# Altium project abacus_main.PrjPcb
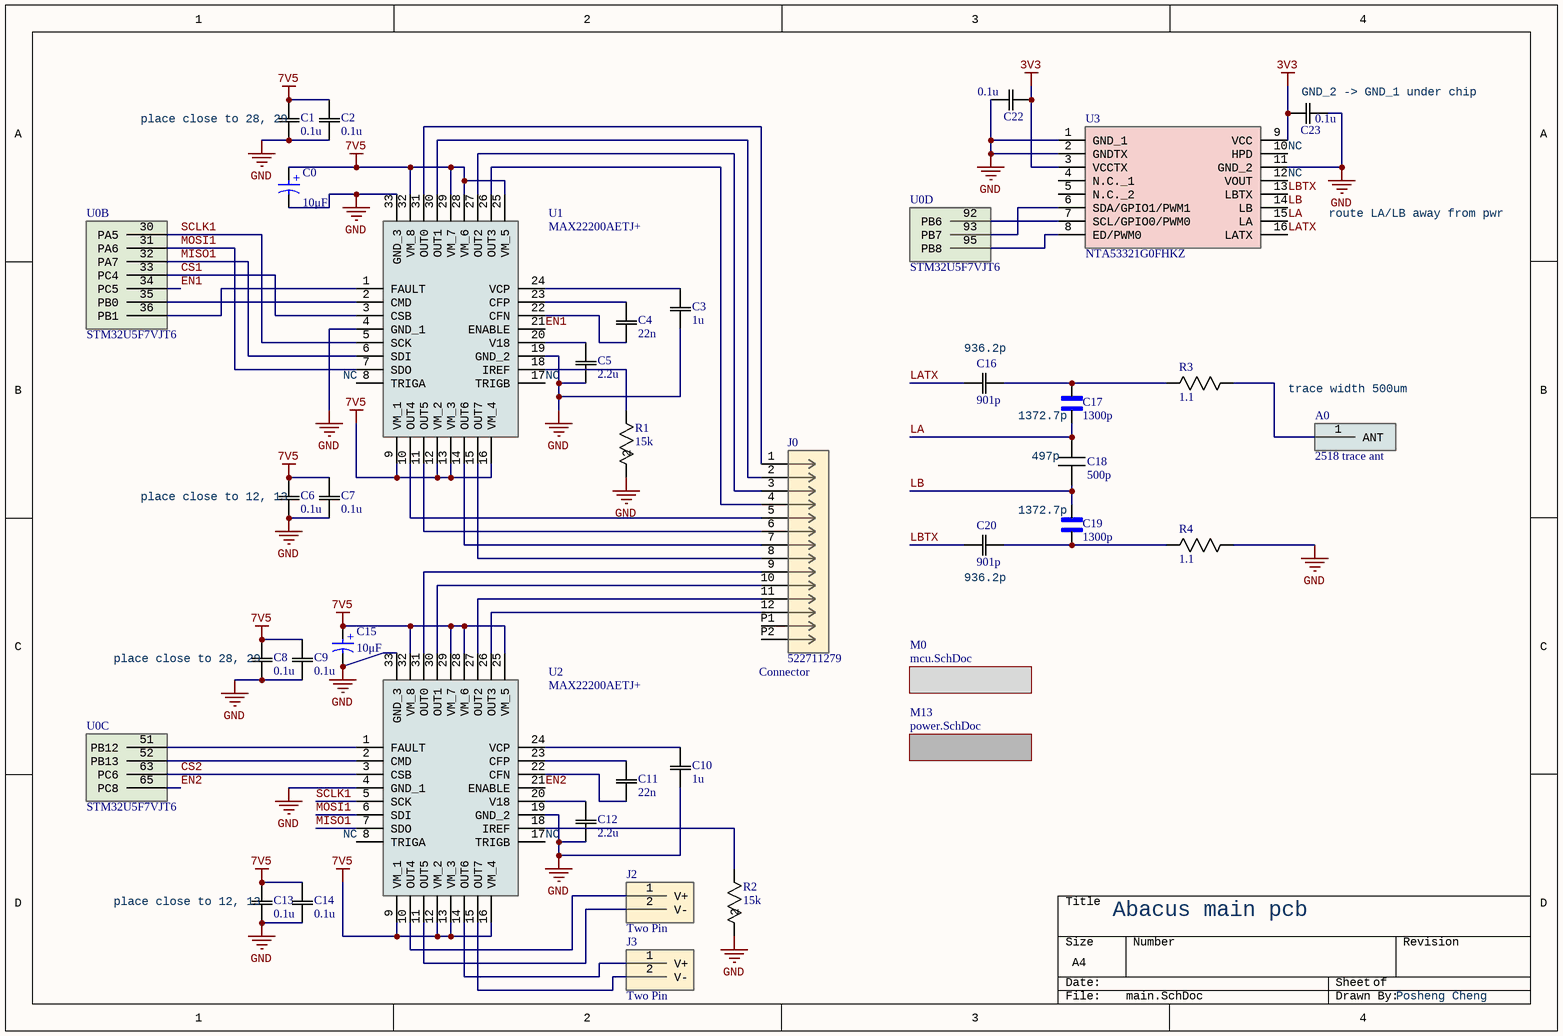
[diagram p0: main.SchDoc]
4 sheets, 117 parts. Net scope: flat (ports and power ports of the same name join across sheets).
Board file: main.PcbDoc
Sheets:
  main.SchDoc
    M0 = mcu.SchDoc
      M9 = hall.SchDoc
      M10 = hall.SchDoc
      M11 = hall.SchDoc
      M12 = hall.SchDoc
      M1 = hall.SchDoc
      M2 = hall.SchDoc
      M3 = hall.SchDoc
      M4 = hall.SchDoc
      M5 = hall.SchDoc
      M6 = hall.SchDoc
      M7 = hall.SchDoc
      M8 = hall.SchDoc
    M13 = power.SchDoc

## Sheet main.SchDoc: Abacus main pcb
size A4; DrawnBy: Posheng Cheng; DocumentNumber: 1; SheetNumber: 1; SheetTotal: 4; SPICEModelCacheAYXZMGLR: <root> / <DocumentId>AYXZMGLR</DocumentId> / <CacheFrame Number="0"> / <Model Name="865080340001_10uf" Kind="CKT"> / <Text>******* / .subckt 865080340001_10uF 1 2 / Rser 1 3 1.3 / Lser 2 4 6.62786597E-10 / C1 3 4 0.00001 / Rpar 3 4 5333333.33333333 / .ends 865080340001_10uF</Text> / </Model> / </CacheFrame> / </root>

### Parts
(Parts that share a designator on the sheet are numbered #1, #2 ... from top to bottom, then left to right.)
A0  2518 trace ant  [NFCANT]
C0  10μF  [WCAP-ASLI_D4H5.5]
C1  0.1u  [CAP_CC0201_YAG]
C2  0.1u  [CAP_CC0201_YAG]
C3  1u  [CAP_CC0201_YAG]
C4  22n  [CAP_CC0201_YAG]
C5  2.2u  [CAP_CC0201_YAG]
C6  0.1u  [CAP_CC0201_YAG]
C7  0.1u  [CAP_CC0201_YAG]
C8  0.1u  [CAP_CC0201_YAG]
C9  0.1u  [CAP_CC0201_YAG]
C10  1u  [CAP_CC0201_YAG]
C11  22n  [CAP_CC0201_YAG]
C12  2.2u  [CAP_CC0201_YAG]
C13  0.1u  [CAP_CC0201_YAG]
C14  0.1u  [CAP_CC0201_YAG]
C15  10μF  [WCAP-ASLI_D4H5.5]
C16  901p  [CAPC17595_87N_KEM]
C17  1300p  [CAPC1608X95N]
C18  500p  [CAPC17595_87N_KEM]
C19  1300p  [CAPC1608X95N]
C20  901p  [CAPC17595_87N_KEM]
C22  0.1u  [CAP_CC0201_YAG]
C23  0.1u  [CAP_CC0201_YAG]
J0  522711279  System: Connector  [CON_522711279_MOL]
J2  Two Pin  [TWO_PIN]
J3  Two Pin  [TWO_PIN]
R1  15k  [RC0603N_PAN]
R2  15k  [RC0603N_PAN]
R3  1.1  [RC0603N_PAN]
R4  1.1  [RC0603N_PAN]
U0#1  STM32U5F7VJT6  [QFP50P1600X1600X160-100N]  (part D of 4)
U0#2  STM32U5F7VJT6  [QFP50P1600X1600X160-100N]  (part B of 2)
U0#3  STM32U5F7VJT6  [QFP50P1600X1600X160-100N]  (part C of 3)
U1  MAX22200AETJ+  [QFN50P500X500X80-33N]
U2  MAX22200AETJ+  [QFN50P500X500X80-33N]
U3  NTA53321G0FHKZ  [NTA53321G0FHKZ]

### Sub-sheets
M0 = mcu.SchDoc: no entries
M13 = power.SchDoc: no entries

### Nets
3V3: C22.2 C23.1 U3.3(VCCTX) U3.9(VCC)
7V5: C0.1(P) C1.2 C2.2 C6.2 C7.2 C8.2 C9.2 C13.2 C14.2 C15.1(P) U1.9(VM_1) U1.12(VM_2) U1.13(VM_3) U1.16(VM_4) U1.25(VM_5) U1.28(VM_6) U1.29(VM_7) U1.32(VM_8) U2.9(VM_1) U2.12(VM_2) U2.13(VM_3) U2.16(VM_4) U2.25(VM_5) U2.28(VM_6) U2.29(VM_7) U2.32(VM_8)
GND: C0.2(N) C1.1 C2.1 C3.1 C5.1 C6.1 C7.1 C8.1 C9.1 C10.1 C12.1 C13.1 C14.1 C15.2(N) C22.1 C23.2 R1.2 R2.2 R4.1 U1.4(GND_1) U1.19(GND_2) U1.33(GND_3) U2.4(GND_1) U2.19(GND_2) U2.33(GND_3) U3.1(GND_1) U3.2(GNDTX) U3.11(GND_2)
CS1: U0#2.33(PC4) U1.3(CSB)
CS2: U0#3.63(PC6) U2.3(CSB)
EN1: U0#2.34(PC5) U1.21(ENABLE)
EN2: U0#3.65(PC8) U2.21(ENABLE)
LA: C17.1 C18.2 U3.15(LA)
LATX: C16.2 U3.16(LATX)
LB: C18.1 C19.2 U3.14(LB)
LBTX: C20.2 U3.13(LBTX)
MISO1: U0#2.32(PA7) U1.6(SDI) U2.7(SDO)
MOSI1: U0#2.31(PA6) U1.7(SDO) U2.6(SDI)
SCLK1: U0#2.30(PA5) U1.5(SCK) U2.5(SCK)
NetA0_1: A0.1(ANT) R3.1
NetC3_2: C3.2 U1.24(VCP)
NetC4_1: C4.1 U1.22(CFN)
NetC4_2: C4.2 U1.23(CFP)
NetC5_2: C5.2 U1.20(V18)
NetC10_2: C10.2 U2.24(VCP)
NetC11_1: C11.1 U2.22(CFN)
NetC11_2: C11.2 U2.23(CFP)
NetC12_2: C12.2 U2.20(V18)
NetC16_1: C16.1 C17.2 R3.2
NetC19_1: C19.1 C20.1 R4.2
NetJ0_1: J0.1 U1.31(OUT0)
NetJ0_2: J0.2 U1.30(OUT1)
NetJ0_3: J0.3 U1.27(OUT2)
NetJ0_4: J0.4 U1.26(OUT3)
NetJ0_5: J0.5 U1.10(OUT4)
NetJ0_6: J0.6 U1.11(OUT5)
NetJ0_7: J0.7 U1.14(OUT6)
NetJ0_8: J0.8 U1.15(OUT7)
NetJ0_9: J0.9 U2.31(OUT0)
NetJ0_10: J0.10 U2.30(OUT1)
NetJ0_11: J0.11 U2.27(OUT2)
NetJ0_12: J0.12 U2.26(OUT3)
NetJ2_1: J2.1(V+) U2.10(OUT4)
NetJ2_2: J2.2(V-) U2.11(OUT5)
NetJ3_1: J3.1(V+) U2.14(OUT6)
NetJ3_2: J3.2(V-) U2.15(OUT7)
NetR1_1: R1.1 U1.18(IREF)
NetR2_1: R2.1 U2.18(IREF)
NetU0#1_92: U0#1.92(PB6) U3.7(SCL/GPIO0/PWM0)
NetU0#1_93: U0#1.93(PB7) U3.6(SDA/GPIO1/PWM1)
NetU0#1_95: U0#1.95(PB8) U3.8(ED/PWM0)
NetU0#2_35: U0#2.35(PB0) U1.2(CMD)
NetU0#2_36: U0#2.36(PB1) U1.1(FAULT)
NetU0#3_51: U0#3.51(PB12) U2.1(FAULT)
NetU0#3_52: U0#3.52(PB13) U2.2(CMD)

Not connected (* = marked no-connect by the designer): J0 P1 P2; U1 8(TRIGA) 17(TRIGB); U2 8(TRIGA) 17(TRIGB); U3 4(N.C._1) 5(N.C._2) 10(HPD) 12(VOUT)

### Notes on the sheet
- (near C23) GND_2 -> GND_1 under chip
- (near C1) place close to 28, 29
- (near U3) NC
- NC
- route LA/LB away from pwr
- (near U1) NC
- (near C16) 936.2p
- (near C17) 1372.7p
- (near A0) trace width 500um
- (near C6) place close to 12, 13
- (near C19) 1372.7p
- (near C18) 497p
- (near C20) 936.2p
- (near C8) place close to 28, 29
- (near U2) NC
- (near C13) place close to 12, 13
- (in symbol 865080340001) +

### Library data of the parts
A0 = Component_1
C0 C15 = 865080340001: WCAP-ASLI Aluminum Electrolytic Capacitor, V-Chip, SMT, 4mm x 5.5mm, 10μF, 16V; Manufacturer: Wurth Elektronik; Dissipation Factor: 16%; Endurance: 2000h; Impedance: 2200mΩ; Leakage Current: 3μA; Ripple Current: 80mA; Manufacturer_Part_Number: 865080340001; Category: Aluminum Electrolytic Capacitors; Match Code: WCAP-ASLI; ComponentLink1Description: Website Link; ComponentLink1URL: https://www.we-online.com/redexpert/article/865080340001?ad; ComponentLink2Description: Datasheet Link; ComponentLink2URL: https://www.we-online.com/redexpert/spec/865080340001?ad; Mount: Surface Mount; Min Operating Temperature: -55°C; Max Operating Temperature: 105°C; Packaging: Tape and Reel; Height: 5.5mm; Diameter: 4mm; Capacitance: 10μF; Rated Voltage (DC): 16V
C1 C2 C6-C9 C13 C14 = CC0201KRX5R7BB104: Description; Manufacturer_Name: Yageo; Copyright: Copyright (C) 2025 Ultra Librarian. All rights reserved.; Manufacturer_Part_Number: CC0201KRX5R7BB104
C3 C10 = CC0201MRX5R5BB105: No Description Available; Manufacturer_Name: Yageo; Copyright: Copyright (C) 2025 Ultra Librarian. All rights reserved.; Manufacturer_Part_Number: CC0201MRX5R5BB105
C4 C11 = CC0201KRX5R7BB223: No Description Available; Manufacturer_Name: Yageo; Copyright: Copyright (C) 2025 Ultra Librarian. All rights reserved.; Manufacturer_Part_Number: CC0201KRX5R7BB223
C5 C12 = CC0201MRX5R5BB225: No Description Available; Manufacturer_Name: Yageo; Copyright: Copyright (C) 2025 Ultra Librarian. All rights reserved.; Manufacturer_Part_Number: CC0201MRX5R5BB225
C16 C20 = C0603C911F5GACTU: SMD Comm C0G, Ceramic, 910 pF, 1%, 50 VDC, C0G, SMD, MLCC, Ultra-Stable, Low Loss, Class I, 0603; Manufacturer_Name: Kemet; Copyright: Copyright (C) 2025 Ultra Librarian. All rights reserved.; Manufacturer_Part_Number: C0603C911F5GACTU; Datasheet: https://content.kemet.com/datasheets/KEM_C1003_C0G_SMD.pdf
C17 C19 = C0603X132F4HACTU: CAP CER 0603 1.3NF 16V ULTRA STA; MF: KEMET; MP: C0603X132F4HAC7867; SnapEDA_Link: https://www.snapeda.com/parts/C0603X132F4HAC7867/KEMET/view-part/?ref=snap; Package: 1608 KEMET; Value: *; Check_prices: https://www.snapeda.com/parts/C0603X132F4HAC7867/KEMET/view-part/?ref=eda; Manufacturer_Part_Number: C0603X132F4HACTU
C18 = CC0603JRNPO9BN501: CC0603JRNPO9BN501 500pF 5%, 50 VDC 0603; Manufacturer_Part_Number: CC0603JRNPO9BN501
C22 C23 = CMP-001-00086-1: Description; Manufacturer_Name: Yageo; Copyright: Copyright (C) 2025 Ultra Librarian. All rights reserved.; Design Item ID: CC0201KRX5R7BB104; Manufacturer_Part_Number: CC0201KRX5R7BB104; Source: CC0201KRX5R7BB104.SchLib
J0 = 522711279: Easy-On FFC/FPC Connector, 1.00mm Pitch, Slider Series, Right-Angle, Bottom Contact, 3.00mm Height, 12 Circuits, Tin-Bismuth Plating; Manufacturer_Name: Molex Connector Corporation; Copyright: Copyright (C) 2025 Ultra Librarian. All rights reserved.; Manufacturer_Part_Number: 522711279; RefDes: RefDes; Type: Type
J2 J3 = two_pin
R1 R2 = ERA-3AEB153V: No Description Available; Manufacturer_Name: Panasonic; Copyright: Copyright (C) 2025 Ultra Librarian. All rights reserved.; Manufacturer_Part_Number: ERA-3AEB153V
R3 R4 = RT0603DRE071R1L: YAGEO, RT, Thin Film, SMD Chip, 1.1 Ohms, 0.5%, 0603 / 1608; Copyright: Copyright (C) 2025 Ultra Librarian. All rights reserved.; Manufacturer_Name: YAGEO; Manufacturer_Part_Number: RT0603DRE071R1L
U0#1-U0#3 = STM32U5F7VJT6: Advanced Graphics and Ultra Low Power  CortexM-33 with Trustzone, NEOCHROM VG GPU, 160MHZ, with 3 MBSRAM and 4M of Flash.; Manufacturer_Name: STMicroelectronics; Geometry.Height: 1.6mm; Manufacturer_Part_Number: STM32U5F7VJT6; Mouser Part Number: 511-STM32U5F7VJT6; Mouser Price/Stock: https://www.mouser.co.uk/ProductDetail/STMicroelectronics/STM32U5F7VJT6?qs=HoCaDK9Nz5e1ZGsW1DPWFA%3D%3D; Arrow Part Number: STM32U5F7VJT6; Arrow Price/Stock: https://www.arrow.com/en/products/stm32u5f7vjt6/stmicroelectronics?region=nac; Datasheet Link: https://www.st.com/resource/en/datasheet/stm32u5f7vj.pdf
U1 U2 = MAX22200AETJ+: Motor/Motion/Ignition Controllers & Drivers 36V, 1A Octal Integrated Serial-Controll; Manufacturer_Name: Analog Devices; Geometry.Height: 0.8mm; Manufacturer_Part_Number: MAX22200AETJ+; Mouser Part Number: *; Mouser Price/Stock: *; Arrow Part Number: MAX22200AETJ+; Arrow Price/Stock: https://www.arrow.com/en/products/max22200aetj/analog-devices?utm_currency=USD&region=nac; Datasheet Link: https://www.analog.com/media/en/technical-documentation/data-sheets/MAX22200.pdf
U3 = NTA53321G0FHKZ: Interface - Specialized NTAG; Manufacturer_Name: NXP; Geometry.Height: 0.5mm; Manufacturer_Part_Number: NTA53321G0FHKZ; Mouser Part Number: 771-NTA53321G0FHKZ; Mouser Price/Stock: https://www.mouser.co.uk/ProductDetail/NXP-Semiconductors/NTA53321G0FHKZ?qs=OlC7AqGiEDk3OpnM8pXHAA%3D%3D; Arrow Part Number: NTA53321G0FHKZ; Arrow Price/Stock: https://www.arrow.com/en/products/nta53321g0fhkz/nxp-semiconductors?region=nac; Datasheet Link: https://www.mouser.co.il/datasheet/2/302/NTA5332-1815294.pdf

## Sheet mcu.SchDoc: Abacus main PCB - MCU
size A4; DrawnBy: Posheng Cheng; SheetNumber: 2; SheetTotal: 3
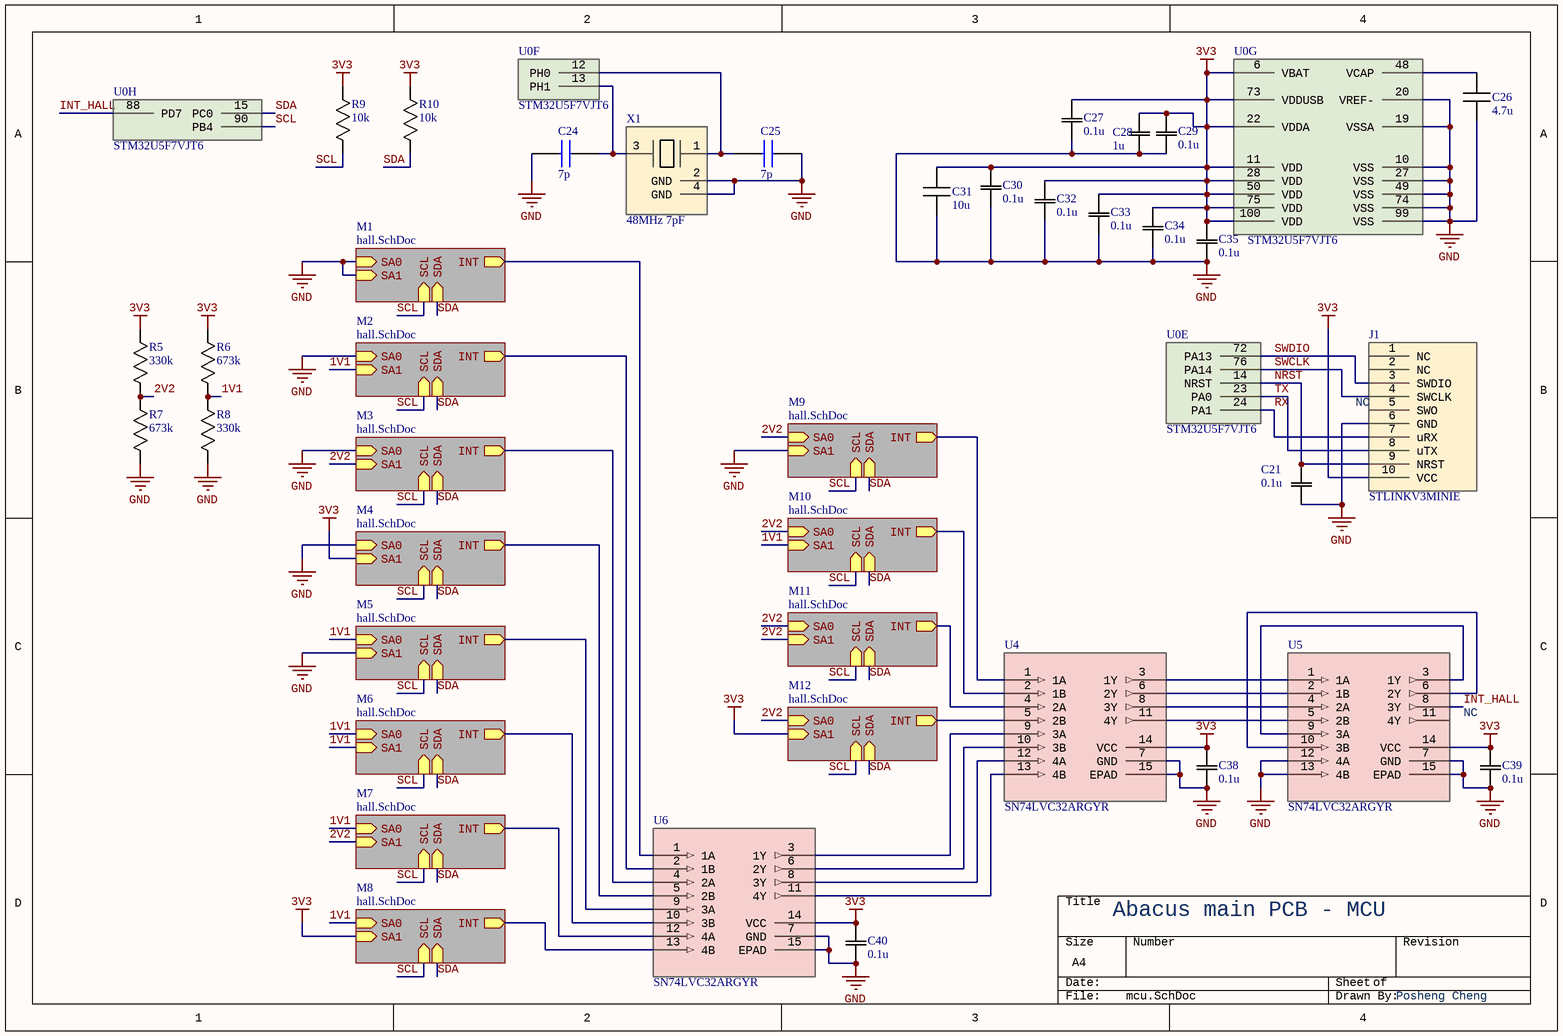
[diagram p1: mcu.SchDoc]

### Parts
(Parts that share a designator on the sheet are numbered #1, #2 ... from top to bottom, then left to right.)
C21  0.1u  [CAP_CC0201_YAG]
C24  7p  [CAPC0603X33N]
C25  7p  [CAPC0603X33N]
C26  4.7u  [CAPC17595_87N_KEM]
C27  0.1u  [CAP_CC0201_YAG]
C28  1u  [CAP_CC0201_YAG]
C29  0.1u  [CAP_CC0201_YAG]
C30  0.1u  [CAP_CC0201_YAG]
C31  10u  [CAPC17595_87N_KEM]
C32  0.1u  [CAP_CC0201_YAG]
C33  0.1u  [CAP_CC0201_YAG]
C34  0.1u  [CAP_CC0201_YAG]
C35  0.1u  [CAP_CC0201_YAG]
C38  0.1u  [CAP_CC0201_YAG]
C39  0.1u  [CAP_CC0201_YAG]
C40  0.1u  [CAP_CC0201_YAG]
J1  STLINKV3MINIE  [009159010061911]
R5  330k  [RC0603N_YAG]
R6  673k  [RC0603N_YAG]
R7  673k  [RC0603N_YAG]
R8  330k  [RC0603N_YAG]
R9  10k  [RC0603N_PAN]
R10  10k  [RC0603N_PAN]
U0#4  STM32U5F7VJT6  [QFP50P1600X1600X160-100N]  (part F of 6)
U0#5  STM32U5F7VJT6  [QFP50P1600X1600X160-100N]  (part G of 7)
U0#6  STM32U5F7VJT6  [QFP50P1600X1600X160-100N]  (part H of 8)
U0#7  STM32U5F7VJT6  [QFP50P1600X1600X160-100N]  (part E of 5)
U4  SN74LVC32ARGYR  [RGY14_2P05X2P05]
U5  SN74LVC32ARGYR  [RGY14_2P05X2P05]
U6  SN74LVC32ARGYR  [RGY14_2P05X2P05]
X1  48MHz 7pF  [ECS-480-7-33B2-CKM-TR3]

### Sub-sheets
M1 = hall.SchDoc: SA0 (in), SA1 (in), SCL (in), SDA (in), INT (out)
M2 = hall.SchDoc: SA0 (in), SA1 (in), SCL (in), SDA (in), INT (out)
M3 = hall.SchDoc: SA0 (in), SA1 (in), SCL (in), SDA (in), INT (out)
M4 = hall.SchDoc: SA0 (in), SA1 (in), SCL (in), SDA (in), INT (out)
M5 = hall.SchDoc: SA0 (in), SA1 (in), SCL (in), SDA (in), INT (out)
M6 = hall.SchDoc: SA0 (in), SA1 (in), SCL (in), SDA (in), INT (out)
M7 = hall.SchDoc: SA0 (in), SA1 (in), SCL (in), SDA (in), INT (out)
M8 = hall.SchDoc: SA0 (in), SA1 (in), SCL (in), SDA (in), INT (out)
M9 = hall.SchDoc: SA0 (in), SA1 (in), SCL (in), SDA (in), INT (out)
M10 = hall.SchDoc: SA0 (in), SA1 (in), SCL (in), SDA (in), INT (out)
M11 = hall.SchDoc: SA0 (in), SA1 (in), SCL (in), SDA (in), INT (out)
M12 = hall.SchDoc: SA0 (in), SA1 (in), SCL (in), SDA (in), INT (out)

### Nets
3V3: C27.2 C28.2 C29.2 C30.2 C31.2 C32.2 C33.2 C34.2 C35.2 C38.1 C39.1 C40.1 J1.10(VCC) R5.1 R6.1 R9.1 R10.2 U0#5.6(VBAT) U0#5.11(VDD) U0#5.22(VDDA) U0#5.28(VDD) U0#5.50(VDD) U0#5.73(VDDUSB) U0#5.75(VDD) U0#5.100(VDD) U4.14(VCC) U5.14(VCC) U6.14(VCC) ; sheet M12/SA1, sheet M4/SA1, sheet M8/SA1
GND: C21.1 C24.1 C25.2 C26.1 C27.1 C28.1 C29.1 C30.1 C31.1 C32.1 C33.1 C34.1 C35.1 C38.2 C39.2 C40.2 J1.6(GND) R7.2 R8.2 U0#5.10(VSS) U0#5.19(VSSA) U0#5.20(VREF-) U0#5.27(VSS) U0#5.49(VSS) U0#5.74(VSS) U0#5.99(VSS) U4.7(GND) U4.15(EPAD) U5.7(GND) U5.12(4A) U5.13(4B) U5.15(EPAD) U6.7(GND) U6.15(EPAD) X1.2(GND) X1.4(GND) ; sheet M9/SA1, sheet M1/SA0, sheet M1/SA1, sheet M2/SA0, sheet M3/SA0, sheet M4/SA0, sheet M5/SA1
1V1: R6.2 R8.1 ; sheet M10/SA1, sheet M2/SA1, sheet M5/SA0, sheet M6/SA0, sheet M6/SA1, sheet M7/SA0, sheet M8/SA0
2V2: R5.2 R7.1 ; sheet M9/SA0, sheet M10/SA0, sheet M11/SA0, sheet M11/SA1, sheet M12/SA0, sheet M3/SA1, sheet M7/SA1
INT_HALL: U0#6.88(PD7) U5.8(3Y)
NRST: C21.2 J1.9(NRST) U0#7.14(NRST)
RX: J1.7(uRX) U0#7.24(PA1)
SCL: R9.2 U0#6.90(PB4) ; sheet M9/SCL, sheet M10/SCL, sheet M11/SCL, sheet M12/SCL, sheet M1/SCL, sheet M2/SCL, sheet M3/SCL, sheet M4/SCL, sheet M5/SCL, sheet M6/SCL, sheet M7/SCL, sheet M8/SCL
SDA: R10.1 U0#6.15(PC0) ; sheet M9/SDA, sheet M10/SDA, sheet M11/SDA, sheet M12/SDA, sheet M1/SDA, sheet M2/SDA, sheet M3/SDA, sheet M4/SDA, sheet M5/SDA, sheet M6/SDA, sheet M7/SDA, sheet M8/SDA
SWCLK: J1.4(SWCLK) U0#7.76(PA14)
SWDIO: J1.3(SWDIO) U0#7.72(PA13)
TX: J1.8(uTX) U0#7.23(PA0)
NetC24_2: C24.2 U0#4.13(PH1) X1.3
NetC25_1: C25.1 U0#4.12(PH0) X1.1
NetC26_2: C26.2 U0#5.48(VCAP)
NetU4_1: U4.1(1A) ; sheet M9/INT
NetU4_2: U4.2(1B) ; sheet M10/INT
NetU4_3: U4.3(1Y) U5.1(1A)
NetU4_4: U4.4(2A) ; sheet M11/INT
NetU4_5: U4.5(2B) ; sheet M12/INT
NetU4_6: U4.6(2Y) U5.2(1B)
NetU4_8: U4.8(3Y) U5.4(2A)
NetU4_9: U4.9(3A) U6.3(1Y)
NetU4_10: U4.10(3B) U6.6(2Y)
NetU4_11: U4.11(4Y) U5.5(2B)
NetU4_12: U4.12(4A) U6.8(3Y)
NetU4_13: U4.13(4B) U6.11(4Y)
NetU5_3: U5.3(1Y) U5.9(3A)
NetU5_6: U5.6(2Y) U5.10(3B)
NetU6_1: U6.1(1A) ; sheet M1/INT
NetU6_2: U6.2(1B) ; sheet M2/INT
NetU6_4: U6.4(2A) ; sheet M3/INT
NetU6_5: U6.5(2B) ; sheet M4/INT
NetU6_9: U6.9(3A) ; sheet M5/INT
NetU6_10: U6.10(3B) ; sheet M6/INT
NetU6_12: U6.12(4A) ; sheet M7/INT
NetU6_13: U6.13(4B) ; sheet M8/INT

Not connected (* = marked no-connect by the designer): J1 1(NC) 2(NC) 5(SWO); U5 11(4Y)

### Notes on the sheet
- (near J1) NC
- NC

### Library data of the parts
C21 C27 C29 C30 C32-C35 = CMP-001-00086-1: Description; Manufacturer_Name: Yageo; Copyright: Copyright (C) 2025 Ultra Librarian. All rights reserved.; Design Item ID: CC0201KRX5R7BB104; Manufacturer_Part_Number: CC0201KRX5R7BB104; Source: CC0201KRX5R7BB104.SchLib
C24 C25 = CBR02C709B5GAC: CBR-SMD RF C0G, Ceramic, 7 pF, +/-0.1 pF, 50 VDC, 125 VDC, 125C, -55C, C0G, SMD, Fixed, RF, Ultra High Q, Low ESR, Class I, 0.18 % , 10 GOhms, 540, 0.3 mg, 0201, 0.6mm, 0.3mm, 0.3mm, 0.15mm, 15000, 78  Weeks, 120; Manufacturer_Name: KEMET; Geometry.Height: 0.33mm; Manufacturer_Part_Number: CBR02C709B5GAC; Mouser Part Number: *; Mouser Price/Stock: *; Arrow Part Number: *; Arrow Price/Stock: *; Datasheet Link: http://www.kemet.com/Lists/ProductCatalog/Attachments/490/KEM_C1030_CBR_SMD.pdf
C26 = C0603C475K8PACTU: C0603C475K8PACTU 4.7uF 4.7 uF, 10%, 10 VDC, X5R; Manufacturer_Part_Number: C0603C475K8PACTU
C28 = CMP-001-00084-1: No Description Available; Manufacturer_Name: Yageo; Design Item ID: CC0201MRX5R5BB105; Manufacturer_Part_Number: CC0201MRX5R5BB105; Source: CC0201MRX5R5BB105.SchLib; Copyright: Copyright (C) 2025 Ultra Librarian. All rights reserved.
C31 = CC0603KRX5R5BB106: CC0603KRX5R5BB106 10 uF, 10%, 6.3 VDC, X5R; Manufacturer_Part_Number: CC0603KRX5R5BB106
C38-C40 = CMP-001-00086-2: Description; Manufacturer_Part_Number: CC0201KRX5R7BB104; Manufacturer_Name: Yageo; Copyright: Copyright (C) 2025 Ultra Librarian. All rights reserved.; Source: CC0201KRX5R7BB104.SchLib; Design Item ID: CC0201KRX5R7BB104
J1 = 009159010061911: KYOCERA-AVX 009159010061911
R5 R8 = RT0603BRD07330KL: No Description Available; Manufacturer_Name: Yageo; Copyright: Copyright (C) 2025 Ultra Librarian. All rights reserved.; Manufacturer_Part_Number: RT0603BRD07330KL
R6 R7 = RT0603BRE07673KL: No Description Available; Manufacturer_Name: Yageo; Copyright: Copyright (C) 2025 Ultra Librarian. All rights reserved.; Manufacturer_Part_Number: RT0603BRE07673KL
R9 R10 = RC0201FR-1310KL: YAGEO, RT, Thin Film, SMD Chip, 10k Ohms, 1%, 0603 / 1608; Copyright: Copyright (C) 2025 Ultra Librarian. All rights reserved.; Manufacturer_Name: YAGEO; Manufacturer_Part_Number: RC0201FR-1310KL
U0#4-U0#7 = STM32U5F7VJT6: as U0#1 on sheet main; Manufacturer_Part_Number: STM32U5F7VJT6; Mouser Part Number: 511-STM32U5F7VJT6; Mouser Price/Stock: https://www.mouser.co.uk/ProductDetail/STMicroelectronics/STM32U5F7VJT6?qs=HoCaDK9Nz5e1ZGsW1DPWFA%3D%3D; Arrow Part Number: STM32U5F7VJT6; Arrow Price/Stock: https://www.arrow.com/en/products/stm32u5f7vjt6/stmicroelectronics?region=nac; Datasheet Link: https://www.st.com/resource/en/datasheet/stm32u5f7vj.pdf
U4-U6 = SN74LVC32ARGYR: Four-channel, two-input, 1.65V to 3.6V 24mA drive strength OR gate 14-VQFN -40 to 125; Manufacturer_Name: Texas Instruments; Copyright: Copyright (C) 2025 Ultra Librarian. All rights reserved.; Manufacturer_Part_Number: SN74LVC32ARGYR; RefDes: RefDes; Type: Type
X1 = ECS-480-7-33B2-CKM-TR3: Manufacturer_Part_Number: ECS-480-7-33B2-CKM-TR3

## Sheet hall.SchDoc: Abacus main pcb - Hall sensors
size A4; DrawnBy: Posheng Cheng; SheetNumber: 3; SheetTotal: 3
Used 12 times, as channels M0/M9, M0/M10, M0/M11, M0/M12, M0/M1, M0/M2, M0/M3, M0/M4, M0/M5, M0/M6, M0/M7, M0/M8. Parts and nets are listed once, with the designators drawn on the sheet.
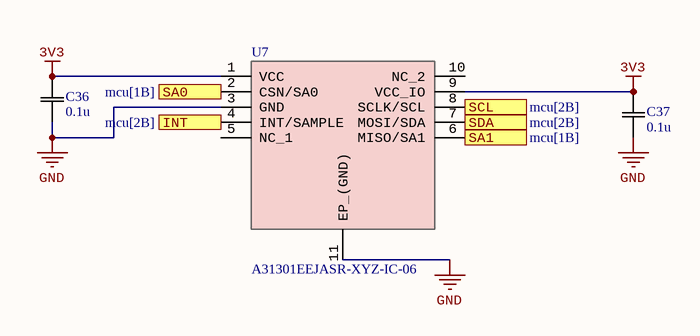
[diagram p2: hall.SchDoc]

### Parts
C36  0.1u  [CAP_CC0201_YAG]
C37  0.1u  [CAP_CC0201_YAG]
U7  A31301EEJASR-XYZ-IC-06  [SON50P300X300X80-11N-D]

### Ports
INT (out, see mcu[2B]), SA0 (in, see mcu[1B]), SA1 (in, see mcu[1B]), SCL (in, see mcu[2B]), SDA (in, see mcu[2B])

### Nets
3V3: C36.2 C37.2 U7.1(VCC) U7.9(VCC_IO)
GND: C36.1 C37.1 U7.3(GND) U7.11(EP_(GND))
INT: U7.4(INT/SAMPLE) ; port INT
SA0: U7.2(CSN/SA0) ; port SA0
SA1: U7.6(MISO/SA1) ; port SA1
SCL: U7.8(SCLK/SCL) ; port SCL
SDA: U7.7(MOSI/SDA) ; port SDA

Not connected (* = marked no-connect by the designer): U7 5(NC_1) 10(NC_2)

### Channels
M0/M9: designators end in _M9; ports INT=NetU7_M1_4 SA0=NetU7_M1_2 SA1=NetU7_M1_6 SCL=NetU7_M1_8 SDA=NetU7_M1_7
M0/M10: designators end in _M10; ports INT=NetU7_M1_4 SA0=NetU7_M1_2 SA1=NetU7_M1_6 SCL=NetU7_M1_8 SDA=NetU7_M1_7
M0/M11: designators end in _M11; ports INT=NetU7_M1_4 SA0=NetU7_M1_2 SA1=NetU7_M1_6 SCL=NetU7_M1_8 SDA=NetU7_M1_7
M0/M12: designators end in _M12; ports INT=NetU7_M1_4 SA0=NetU7_M1_2 SA1=NetU7_M1_6 SCL=NetU7_M1_8 SDA=NetU7_M1_7
M0/M1: designators end in _M1; ports INT=NetU7_M1_4 SA0=NetU7_M1_2 SA1=NetU7_M1_6 SCL=NetU7_M1_8 SDA=NetU7_M1_7
M0/M2: designators end in _M2; ports INT=NetU7_M1_4 SA0=NetU7_M1_2 SA1=NetU7_M1_6 SCL=NetU7_M1_8 SDA=NetU7_M1_7
M0/M3: designators end in _M3; ports INT=NetU7_M1_4 SA0=NetU7_M1_2 SA1=NetU7_M1_6 SCL=NetU7_M1_8 SDA=NetU7_M1_7
M0/M4: designators end in _M4; ports INT=NetU7_M1_4 SA0=NetU7_M1_2 SA1=NetU7_M1_6 SCL=NetU7_M1_8 SDA=NetU7_M1_7
M0/M5: designators end in _M5; ports INT=NetU7_M1_4 SA0=NetU7_M1_2 SA1=NetU7_M1_6 SCL=NetU7_M1_8 SDA=NetU7_M1_7
M0/M6: designators end in _M6; ports INT=NetU7_M1_4 SA0=NetU7_M1_2 SA1=NetU7_M1_6 SCL=NetU7_M1_8 SDA=NetU7_M1_7
M0/M7: designators end in _M7; ports INT=NetU7_M1_4 SA0=NetU7_M1_2 SA1=NetU7_M1_6 SCL=NetU7_M1_8 SDA=NetU7_M1_7
M0/M8: designators end in _M8; ports INT=NetU7_M1_4 SA0=NetU7_M1_2 SA1=NetU7_M1_6 SCL=NetU7_M1_8 SDA=NetU7_M1_7

### Library data of the parts
C36 C37 = CMP-001-00086-1: Description; Manufacturer_Name: Yageo; Copyright: Copyright (C) 2025 Ultra Librarian. All rights reserved.; Design Item ID: CC0201KRX5R7BB104; Manufacturer_Part_Number: CC0201KRX5R7BB104; Source: CC0201KRX5R7BB104.SchLib
U7 = A31301EEJASR-XYZ-IC-06: 3D Linear Hall-Effect Sensor with SPI, I2C Interfaces, and Advanced Low-Power Management; Manufacturer_Name: Allegro Microsystems; Geometry.Height: 0.8mm; Manufacturer_Part_Number: A31301EEJASR-XYZ-IC-06; Mouser Part Number: 250-A31301EEJASRIC06; Mouser Price/Stock: https://www.mouser.co.uk/ProductDetail/Allegro-MicroSystems/A31301EEJASR-XYZ-IC-06?qs=ST9lo4GX8V09bDUIBZAaKw%3D%3D; Arrow Part Number: A31301EEJASR-XYZ-IC-06; Arrow Price/Stock: https://www.arrow.com/en/products/a31301eejasr-xyz-ic-06/allegro-microsystems?utm_currency=USD&region=nac; Datasheet Link: https://www.allegromicro.com/en/

## Sheet power.SchDoc: Abacus main PCB - Power
size A4; DrawnBy: Posheng Cheng; SheetNumber: 4; SheetTotal: 4
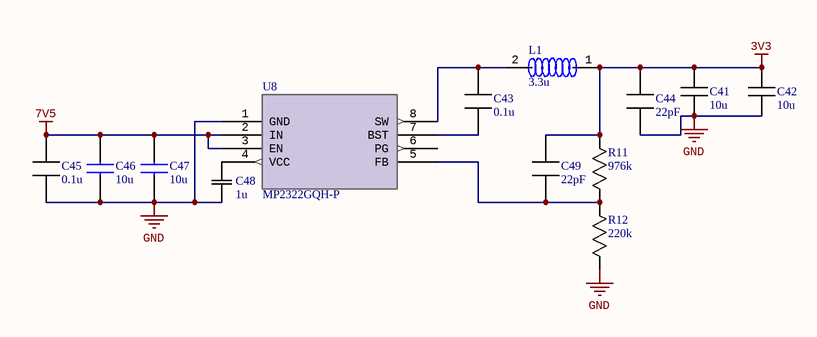
[diagram p3: power.SchDoc]

### Parts
C41  10u  [CAPC17595_87N_KEM]
C42  10u  [CAPC17595_87N_KEM]
C43  0.1u  [CAPC17595_87N_KEM]
C44  22pF  [CAPC17595_87N_KEM]
C45  0.1u  [CAPC17595_87N_KEM]
C46  10u  [CAPC2012X145N]
C47  10u  [CAPC2012X145N]
C48  1u  [CAP_CC0201_YAG]
C49  22pF  [CAPC17595_87N_KEM]
L1  3.3u  [MPL-AT2512-XXX]
R11  976k  [RC0603N_PAN]
R12  220k  [RC0603N_PAN]
U8  MP2322GQH-P  [QFN-8_1p5MMx2MM_MNP]

### Nets
3V3: C41.2 C42.2 C44.1 C49.1 L1.1 R11.1
7V5: C45.2 C46.2 C47.2 U8.2(IN) U8.3(EN)
GND: C41.1 C42.1 C44.2 C45.1 C46.1 C47.1 C48.1 R12.2 U8.1(GND)
NetC43_1: C43.1 L1.2 U8.8(SW)
NetC43_2: C43.2 U8.7(BST)
NetC48_2: C48.2 U8.4(VCC)
NetC49_2: C49.2 R11.2 R12.1 U8.5(FB)

Not connected (* = marked no-connect by the designer): U8 6(PG)

### Library data of the parts
C41 C42 = CC0603KRX5R5BB106: as C31 on sheet mcu; Manufacturer_Part_Number: CC0603KRX5R5BB106
C43 C45 = CC0603KRX7R9BB104: 50V X7R 0603; Manufacturer_Part_Number: CC0603KRX7R9BB104
C44 C49 = C0603C220J1GACTU: 22pF C0G, 22 pF, 5%, 100 VDC, C0G; Manufacturer_Part_Number: C0603C220J1GACTU
C46 C47 = CC0805KKX5R8BB106: Multilayer Ceramic Capacitors MLCC - SMD/SMT The factory is currently not accepting orders for this product.10 uF,25V; Manufacturer_Name: YAGEO; Geometry.Height: 1.45mm; Manufacturer_Part_Number: CC0805KKX5R8BB106; Mouser Part Number: 603-CC805KKX5R8BB106; Mouser Price/Stock: https://www.mouser.co.uk/ProductDetail/YAGEO/CC0805KKX5R8BB106?qs=57cj7OiSijm89pM64t1AGQ%3D%3D; Arrow Part Number: CC0805KKX5R8BB106; Arrow Price/Stock: https://www.arrow.com/en/products/cc0805kkx5r8bb106/yageo?utm_currency=USD&region=nac; Datasheet Link: https://www.yageo.com/upload/media/product/productsearch/datasheet/mlcc/UPY-GPHC_X5R_4V-to-50V_27.pdf
C48 = CMP-001-00084-1: as C28 on sheet mcu; Design Item ID: CC0201MRX5R5BB105; Manufacturer_Part_Number: CC0201MRX5R5BB105; Source: CC0201MRX5R5BB105.SchLib; Copyright: Copyright (C) 2025 Ultra Librarian. All rights reserved.
L1 = MPL-AT2512-3R3: Low-Profile Molded Inductor 3.3µH; Manufacturer_Part_Number: MPL-AT2512-3R3
R11 = RT0603BRD07976KL: Manufacturer_Part_Number: RT0603BRD07976KL
R12 = RT0603BRD07220KL: Manufacturer_Part_Number: RT0603BRD07220KL
U8 = MP2322GQH-P: 1A 3V to 22V 5Î¼A IQ Synchronous Step-Down Converter in a QFN-8 (1.5mmx2mm) Package; Manufacturer_Name: Monolithic Power Systems; Copyright: Copyright (C) 2025 Ultra Librarian. All rights reserved.; Manufacturer_Part_Number: MP2322GQH-P; Datasheet: https://www.monolithicpower.com/en/documentview/productdocument/index/version/2/document_type/Datasheet/lang/en/sku/MP2322; RefDes: RefDes; Type: Type

## Nets that join several sheets
3V3: main (C22.2 C23.1 U3.3 U3.9), mcu (28 pins), M0/M9 (C36_M9.2 C37_M9.2 U7_M9.1 U7_M9.9), M0/M10 (C36_M10.2 C37_M10.2 U7_M10.1 U7_M10.9), M0/M11 (C36_M11.2 C37_M11.2 U7_M11.1 U7_M11.9), M0/M12 (C36_M12.2 C37_M12.2 U7_M12.1 U7_M12.9), M0/M1 (C36_M1.2 C37_M1.2 U7_M1.1 U7_M1.9), M0/M2 (C36_M2.2 C37_M2.2 U7_M2.1 U7_M2.9), M0/M3 (C36_M3.2 C37_M3.2 U7_M3.1 U7_M3.9), M0/M4 (C36_M4.2 C37_M4.2 U7_M4.1 U7_M4.9), M0/M5 (C36_M5.2 C37_M5.2 U7_M5.1 U7_M5.9), M0/M6 (C36_M6.2 C37_M6.2 U7_M6.1 U7_M6.9), M0/M7 (C36_M7.2 C37_M7.2 U7_M7.1 U7_M7.9), M0/M8 (C36_M8.2 C37_M8.2 U7_M8.1 U7_M8.9), power (6 pins)
7V5: main (26 pins), power (5 pins)
GND: main (28 pins), mcu (36 pins), M0/M9 (C36_M9.1 C37_M9.1 U7_M9.3 U7_M9.11), M0/M10 (C36_M10.1 C37_M10.1 U7_M10.3 U7_M10.11), M0/M11 (C36_M11.1 C37_M11.1 U7_M11.3 U7_M11.11), M0/M12 (C36_M12.1 C37_M12.1 U7_M12.3 U7_M12.11), M0/M1 (C36_M1.1 C37_M1.1 U7_M1.3 U7_M1.11), M0/M2 (C36_M2.1 C37_M2.1 U7_M2.3 U7_M2.11), M0/M3 (C36_M3.1 C37_M3.1 U7_M3.3 U7_M3.11), M0/M4 (C36_M4.1 C37_M4.1 U7_M4.3 U7_M4.11), M0/M5 (C36_M5.1 C37_M5.1 U7_M5.3 U7_M5.11), M0/M6 (C36_M6.1 C37_M6.1 U7_M6.3 U7_M6.11), M0/M7 (C36_M7.1 C37_M7.1 U7_M7.3 U7_M7.11), M0/M8 (C36_M8.1 C37_M8.1 U7_M8.3 U7_M8.11), power (9 pins)
NetU7_M1_2: M0/M9 (U7_M9.2), M0/M10 (U7_M10.2), M0/M11 (U7_M11.2), M0/M12 (U7_M12.2), M0/M1 (U7_M1.2), M0/M2 (U7_M2.2), M0/M3 (U7_M3.2), M0/M4 (U7_M4.2), M0/M5 (U7_M5.2), M0/M6 (U7_M6.2), M0/M7 (U7_M7.2), M0/M8 (U7_M8.2)
NetU7_M1_4: M0/M9 (U7_M9.4), M0/M10 (U7_M10.4), M0/M11 (U7_M11.4), M0/M12 (U7_M12.4), M0/M1 (U7_M1.4), M0/M2 (U7_M2.4), M0/M3 (U7_M3.4), M0/M4 (U7_M4.4), M0/M5 (U7_M5.4), M0/M6 (U7_M6.4), M0/M7 (U7_M7.4), M0/M8 (U7_M8.4)
NetU7_M1_6: M0/M9 (U7_M9.6), M0/M10 (U7_M10.6), M0/M11 (U7_M11.6), M0/M12 (U7_M12.6), M0/M1 (U7_M1.6), M0/M2 (U7_M2.6), M0/M3 (U7_M3.6), M0/M4 (U7_M4.6), M0/M5 (U7_M5.6), M0/M6 (U7_M6.6), M0/M7 (U7_M7.6), M0/M8 (U7_M8.6)
NetU7_M1_7: M0/M9 (U7_M9.7), M0/M10 (U7_M10.7), M0/M11 (U7_M11.7), M0/M12 (U7_M12.7), M0/M1 (U7_M1.7), M0/M2 (U7_M2.7), M0/M3 (U7_M3.7), M0/M4 (U7_M4.7), M0/M5 (U7_M5.7), M0/M6 (U7_M6.7), M0/M7 (U7_M7.7), M0/M8 (U7_M8.7)
NetU7_M1_8: M0/M9 (U7_M9.8), M0/M10 (U7_M10.8), M0/M11 (U7_M11.8), M0/M12 (U7_M12.8), M0/M1 (U7_M1.8), M0/M2 (U7_M2.8), M0/M3 (U7_M3.8), M0/M4 (U7_M4.8), M0/M5 (U7_M5.8), M0/M6 (U7_M6.8), M0/M7 (U7_M7.8), M0/M8 (U7_M8.8)